# Altium schematic sheet 2-PWR_MANAGE.SchDoc
size A4
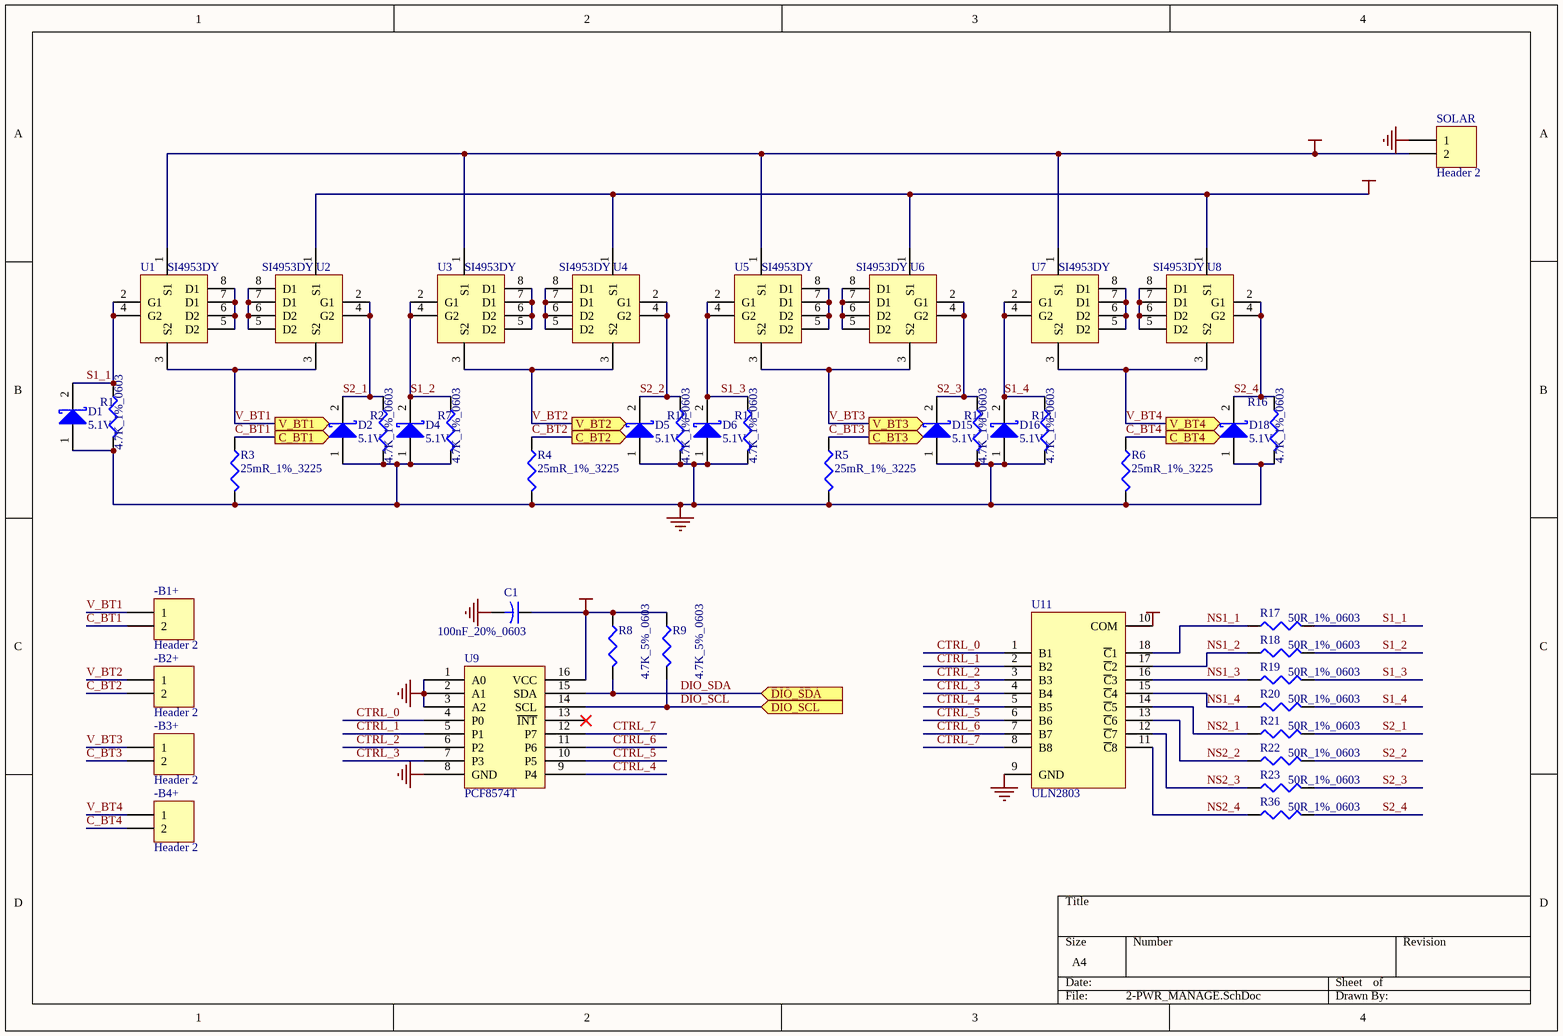
[diagram p0: 2-PWR_MANAGE.SchDoc]

## Parts
-B1+  Header 2  [VH-02H]
-B2+  Header 2  [VH-02H]
-B3+  Header 2  [VH-02H]
-B4+  Header 2  [VH-02H]
C1  100nF_20%_0603  [C1608-0603]
D1  5.1V  [LED0805]
D2  5.1V  [LED0805]
D4  5.1V  [LED0805]
D5  5.1V  [LED0805]
D6  5.1V  [LED0805]
D15  5.1V  [LED0805]
D16  5.1V  [LED0805]
D18  5.1V  [LED0805]
R1  4.7K_1%_0603  [C1608-0603]
R2  4.7K_1%_0603  [C1608-0603]
R3  25mR_1%_3225  [CR6332-2512]
R4  25mR_1%_3225  [CR6332-2512]
R5  25mR_1%_3225  [CR6332-2512]
R6  25mR_1%_3225  [CR6332-2512]
R7  4.7K_1%_0603  [C1608-0603]
R8  4.7K_5%_0603  [C1608-0603]
R9  4.7K_5%_0603  [C1608-0603]
R10  4.7K_1%_0603  [C1608-0603]
R11  4.7K_1%_0603  [C1608-0603]
R12  4.7K_1%_0603  [C1608-0603]
R13  4.7K_1%_0603  [C1608-0603]
R16  4.7K_1%_0603  [C1608-0603]
R17  50R_1%_0603  [C1608-0603]
R18  50R_1%_0603  [C1608-0603]
R19  50R_1%_0603  [C1608-0603]
R20  50R_1%_0603  [C1608-0603]
R21  50R_1%_0603  [C1608-0603]
R22  50R_1%_0603  [C1608-0603]
R23  50R_1%_0603  [C1608-0603]
R36  50R_1%_0603  [C1608-0603]
SOLAR  Header 2  [VH-02H]
U1  SI4953DY  [SO-8]
U2  SI4953DY  [SO-8]
U3  SI4953DY  [SO-8]
U4  SI4953DY  [SO-8]
U5  SI4953DY  [SO-8]
U6  SI4953DY  [SO-8]
U7  SI4953DY  [SO-8]
U8  SI4953DY  [SO-8]
U9  PCF8574T  [SOP16_P1.27_B10]
U11  ULN2803  [SOP18_P1.28_B10]

## Ports
C_BT1 (out), C_BT2 (out), C_BT3 (out), C_BT4 (out), DIO_SCL (in), DIO_SDA (in), V_BT1 (out), V_BT2 (out), V_BT3 (out), V_BT4 (out)

## Nets
GND: C1.2 D1.1(A) D2.1(A) D4.1(A) D5.1(A) D6.1(A) D15.1(A) D16.1(A) D18.1(A) R1.2 R2.2 R3.2 R4.2 R5.2 R6.2 R7.2 R10.2 R11.2 R12.2 R13.2 R16.2 SOLAR.1 U9.1(A0) U9.2(A1) U9.3(A2) U9.8(GND) U11.9(GND)
VCC_3V3: C1.1 R8.1 R9.1 U9.16(VCC)
VCC_5V: U11.10(COM)
VCC_BAT: U2.1(S1) U4.1(S1) U6.1(S1) U8.1(S1)
VCC_CHARGE: SOLAR.2 U1.1(S1) U3.1(S1) U5.1(S1) U7.1(S1)
C_BT1: -B1+.2 R3.1 ; port C_BT1
C_BT2: -B2+.2 R4.1 ; port C_BT2
C_BT3: -B3+.2 R5.1 ; port C_BT3
C_BT4: -B4+.2 R6.1 ; port C_BT4
CTRL_0: U9.4(P0) U11.1(B1)
CTRL_1: U9.5(P1) U11.2(B2)
CTRL_2: U9.6(P2) U11.3(B3)
CTRL_3: U9.7(P3) U11.4(B4)
CTRL_4: U9.9(P4) U11.5(B5)
CTRL_5: U9.10(P5) U11.6(B6)
CTRL_6: U9.11(P6) U11.7(B7)
CTRL_7: U9.12(P7) U11.8(B8)
DIO_SCL: R9.2 U9.14(SCL) ; port DIO_SCL
DIO_SDA: R8.2 U9.15(SDA) ; port DIO_SDA
NS1_1: R17.1 U11.18(~{C}1)
NS1_2: R18.1 U11.17(~{C}2)
NS1_3: R19.1 U11.16(~{C}3)
NS1_4: R20.1 U11.15(~{C}4)
NS2_1: R21.1 U11.14(~{C}5)
NS2_2: R22.1 U11.13(~{C}6)
NS2_3: R23.1 U11.12(~{C}7)
NS2_4: R36.1 U11.11(~{C}8)
S1_1: D1.2(K) R1.1 R17.2 U1.2(G1) U1.4(G2)
S1_2: D4.2(K) R7.1 R18.2 U3.2(G1) U3.4(G2)
S1_3: D6.2(K) R11.1 R19.2 U5.2(G1) U5.4(G2)
S1_4: D16.2(K) R13.1 R20.2 U7.2(G1) U7.4(G2)
S2_1: D2.2(K) R2.1 R21.2 U2.2(G1) U2.4(G2)
S2_2: D5.2(K) R10.1 R22.2 U4.2(G1) U4.4(G2)
S2_3: D15.2(K) R12.1 R23.2 U6.2(G1) U6.4(G2)
S2_4: D18.2(K) R16.1 R36.2 U8.2(G1) U8.4(G2)
V_BT1: -B1+.1 U1.3(S2) U2.3(S2) ; port V_BT1
V_BT2: -B2+.1 U3.3(S2) U4.3(S2) ; port V_BT2
V_BT3: -B3+.1 U5.3(S2) U6.3(S2) ; port V_BT3
V_BT4: -B4+.1 U7.3(S2) U8.3(S2) ; port V_BT4
NetU1_5: U1.5(D2) U1.6(D2) U1.7(D1) U1.8(D1)
NetU2_5: U2.5(D2) U2.6(D2) U2.7(D1) U2.8(D1)
NetU3_5: U3.5(D2) U3.6(D2) U3.7(D1) U3.8(D1)
NetU4_5: U4.5(D2) U4.6(D2) U4.7(D1) U4.8(D1)
NetU5_5: U5.5(D2) U5.6(D2) U5.7(D1) U5.8(D1)
NetU6_5: U6.5(D2) U6.6(D2) U6.7(D1) U6.8(D1)
NetU7_5: U7.5(D2) U7.6(D2) U7.7(D1) U7.8(D1)
NetU8_5: U8.5(D2) U8.6(D2) U8.7(D1) U8.8(D1)

Not connected (* = marked no-connect by the designer): U9 13(~{INT})*

## Library data of the parts
-B1+ -B2+ -B3+ -B4+ SOLAR = Header 2: Header, 2-Pin; LatestRevisionDate: 17-Jul-2002; LatestRevisionNote: Re-released for DXP Platform.; Publisher: Altium Limited
C1 = Cap2: Capacitor; Value: 0.1uF; Published: 23-Sep-2002; Publisher: Altium Limited
D1 D2 D4-D6 D15 D16 D18 = D Schottky: Schottky Diode; Code - JEDEC: DO-214-AA; Published: 8-Jun-2000; Revision: July-2002: Re-released for DXP Platform.; Publisher: Altium Limited
R1 R2 R7-R13 R16-R23 R36 = Res3: Resistor; Value: 1K%5 0603; Published: 8-Jun-2000; Revision: July-2002: Re-released for DXP Platform.; Publisher: Altium Limited
R3-R6 = Res3: Resistor; Value: 150R %5 0603; Published: 8-Jun-2000; Revision: July-2002: Re-released for DXP Platform.; Publisher: Altium Limited